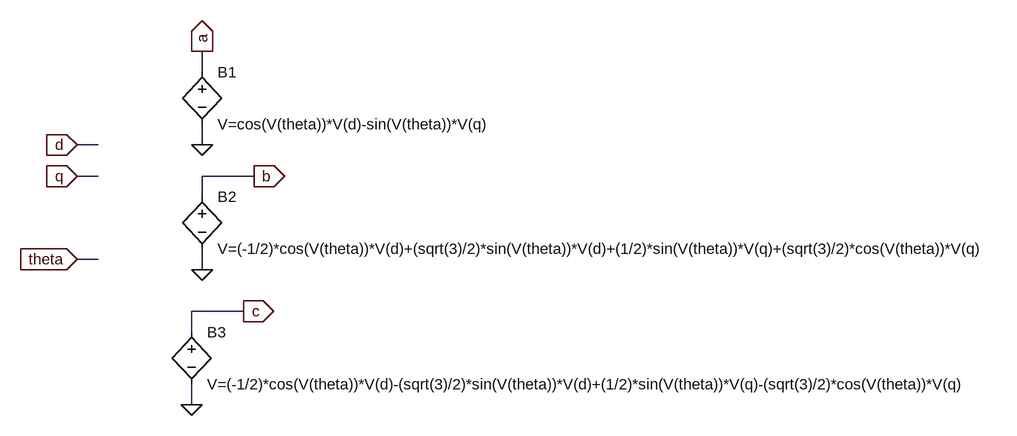
[diagram p0: schematic dqtoabc.asc]
dqtoabc.asc, the LTspice schematic file:
Version 4
SHEET 1 2204 680
WIRE 336 -16 336 -48
WIRE 176 96 144 96
WIRE 336 96 336 64
WIRE 176 144 144 144
WIRE 416 144 336 144
WIRE 336 176 336 144
WIRE 176 272 144 272
WIRE 336 288 336 256
WIRE 400 352 320 352
WIRE 320 384 320 352
WIRE 320 496 320 464
FLAG 144 96 d
IOPIN 144 96 In
FLAG 144 144 q
IOPIN 144 144 In
FLAG 144 272 theta
IOPIN 144 272 In
FLAG 336 288 0
FLAG 336 96 0
FLAG 320 496 0
FLAG 336 -48 a
IOPIN 336 -48 Out
FLAG 416 144 b
IOPIN 416 144 Out
FLAG 400 352 c
IOPIN 400 352 Out
SYMBOL bv 336 -32 R0
SYMATTR InstName B1
SYMATTR Value V=cos(V(theta))*V(d)-sin(V(theta))*V(q)
SYMBOL bv 336 160 R0
SYMATTR InstName B2
SYMATTR Value V=(-1/2)*cos(V(theta))*V(d)+(sqrt(3)/2)*sin(V(theta))*V(d)+(1/2)*sin(V(theta))*V(q)+(sqrt(3)/2)*cos(V(theta))*V(q)
SYMBOL bv 320 368 R0
SYMATTR InstName B3
SYMATTR Value V=(-1/2)*cos(V(theta))*V(d)-(sqrt(3)/2)*sin(V(theta))*V(d)+(1/2)*sin(V(theta))*V(q)-(sqrt(3)/2)*cos(V(theta))*V(q)

The netlist it stands for:
* dqtoabc.asc
B1 a 0 V=cos(V(theta))*V(d)-sin(V(theta))*V(q)
B2 b 0 V=(-1/2)*cos(V(theta))*V(d)+(sqrt(3)/2)*sin(V(theta))*V(d)+(1/2)*sin(V(theta))*V(q)+(sqrt(3)/2)*cos(V(theta))*V(q)
B3 c 0 V=(-1/2)*cos(V(theta))*V(d)-(sqrt(3)/2)*sin(V(theta))*V(d)+(1/2)*sin(V(theta))*V(q)-(sqrt(3)/2)*cos(V(theta))*V(q)
.backanno
.end